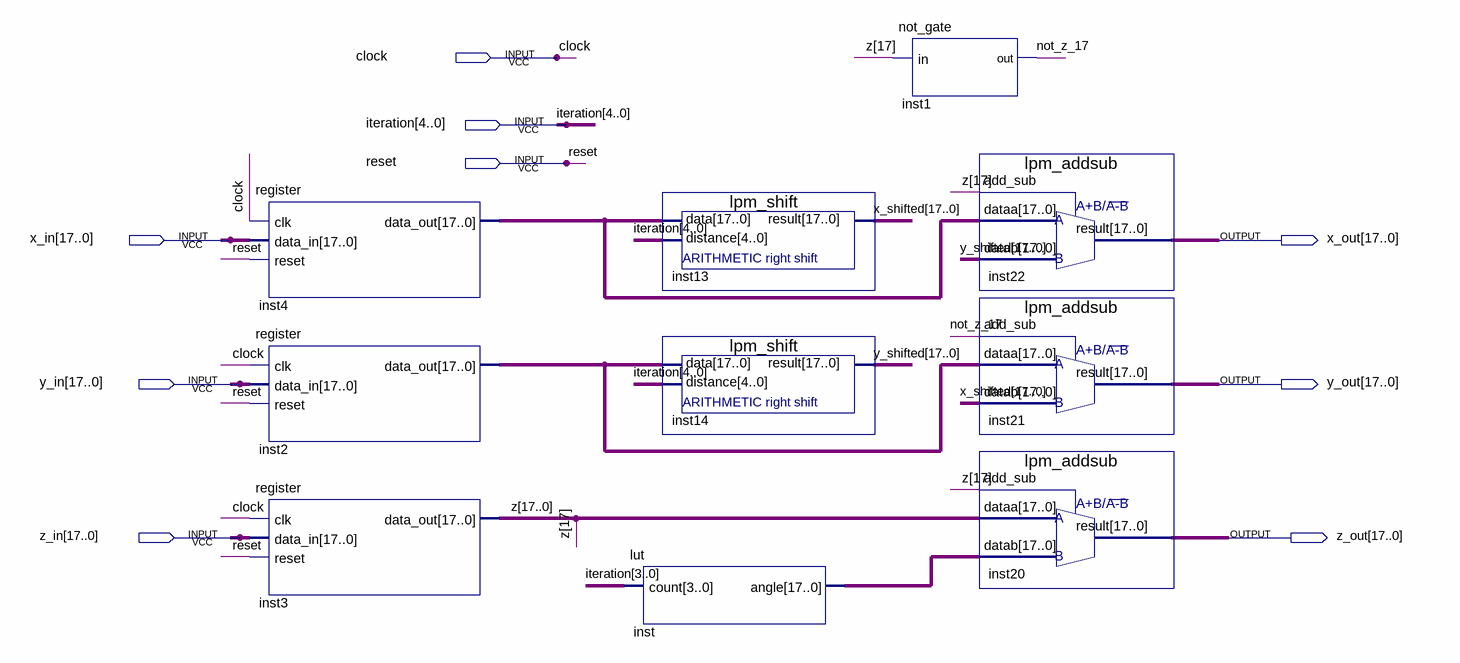
[diagram p0: schematic sheet]
// Quartus schematic cordic_iteration.bdf as structural Verilog: 10 symbols, 9 pins
module cordic_iteration (
  input  clock,
  input  [4:0] iteration,
  input  reset,
  input  [17:0] x_in,
  input  [17:0] y_in,
  input  [17:0] z_in,
  output [17:0] x_out,
  output [17:0] y_out,
  output [17:0] z_out
);

  wire not_z_17;
  wire [17:0] inst2_data_out, inst4_data_out, inst_angle, x_shifted, y_shifted, z;

  register inst4 (.clk(clock), .data_in(x_in), .reset(reset), .data_out(inst4_data_out));
  register inst2 (.clk(clock), .data_in(y_in), .reset(reset), .data_out(inst2_data_out));
  register inst3 (.clk(clock), .data_in(z_in), .reset(reset), .data_out(z));
  lpm_shift inst13 (.data(inst4_data_out), .distance(iteration), .result(x_shifted));
  lpm_shift inst14 (.data(inst2_data_out), .distance(iteration), .result(y_shifted));
  lut inst (.count(iteration[3:0]), .angle(inst_angle));
  not_gate inst1 (.in(z[17]), .out(not_z_17));
  lpm_addsub inst22 (.add_sub(z[17]), .dataa(inst4_data_out), .datab(y_shifted), .result(x_out));
  lpm_addsub inst21 (.add_sub(not_z_17), .dataa(inst2_data_out), .datab(x_shifted), .result(y_out));
  lpm_addsub inst20 (.add_sub(z[17]), .dataa(z), .datab(inst_angle), .result(z_out));
endmodule
